# Altium schematic sheet 5x20 BLX-Atype Fuse holder XC-71_5x20 BLX-Atype Fuse holder XC-7.schdoc
size 124 x 101 mm
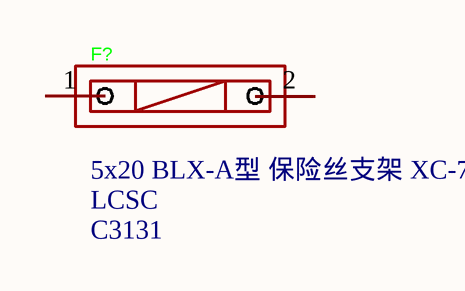
[diagram p0: 5x20 BLX-Atype Fuse holder XC-71_5x20 BLX-Atype Fuse holder XC-7.schdoc]

## Parts
F?  Supplier Part: C3131  Supplier: LCSC  [FUSE-TH_L22.6-W9.0]  (hidden comment: 5x20 BLX-A型 保险丝支架 XC-7)

## Nets

Not connected (* = marked no-connect by the designer): F? 1 2

## Library data of the parts
F? = 5x20 BLX-A型 保险丝支架 XC-7: Manufacturer: xcfuse(旭程); Symbol: 5x20 BLX-Atype Fuse holder XC-7; Add into BOM: yes; Fuseholder Type: Bracket type; Number of Circuits: 1; Voltage Rating: 250V; Current Rating: 6.3A; Fuse Type: Cylindrical; Fuse Diameter (φD): 5.2mm; Fuse Length: 20mm; Device: 5x20 BLX-A型 保险丝支架 XC-7; Manufacturer Part: 5x20 BLX-A型 保险丝支架 XC-7; LCSC Part Name: 保险丝座 5x20 BLX-A型; Supplier Footprint: 插件; JLCPCB Part Class: Extended Part; Datasheet: https://item.szlcsc.com/datasheet/5x20%2520BLX-A%25E5%259E%258B%2520%25E4%25BF%259D%25E9%2599%25A9%25E4%25B8%259D%25E6%2594%25AF%25E6%259E%25B6%2520XC-7/3520.html; Convert to PCB: yes